# EasyEDA schematic SCH_6 Channel Energy Monitor 17-09-2023 Finished_2023-09-29.json
TITLE: 6 Channel Energy Monitor; REV: 1.0; Date: 2023-09-06; Sheet: 1/1; Drawn By: ChrisHayes31; Company: Shaw Communications
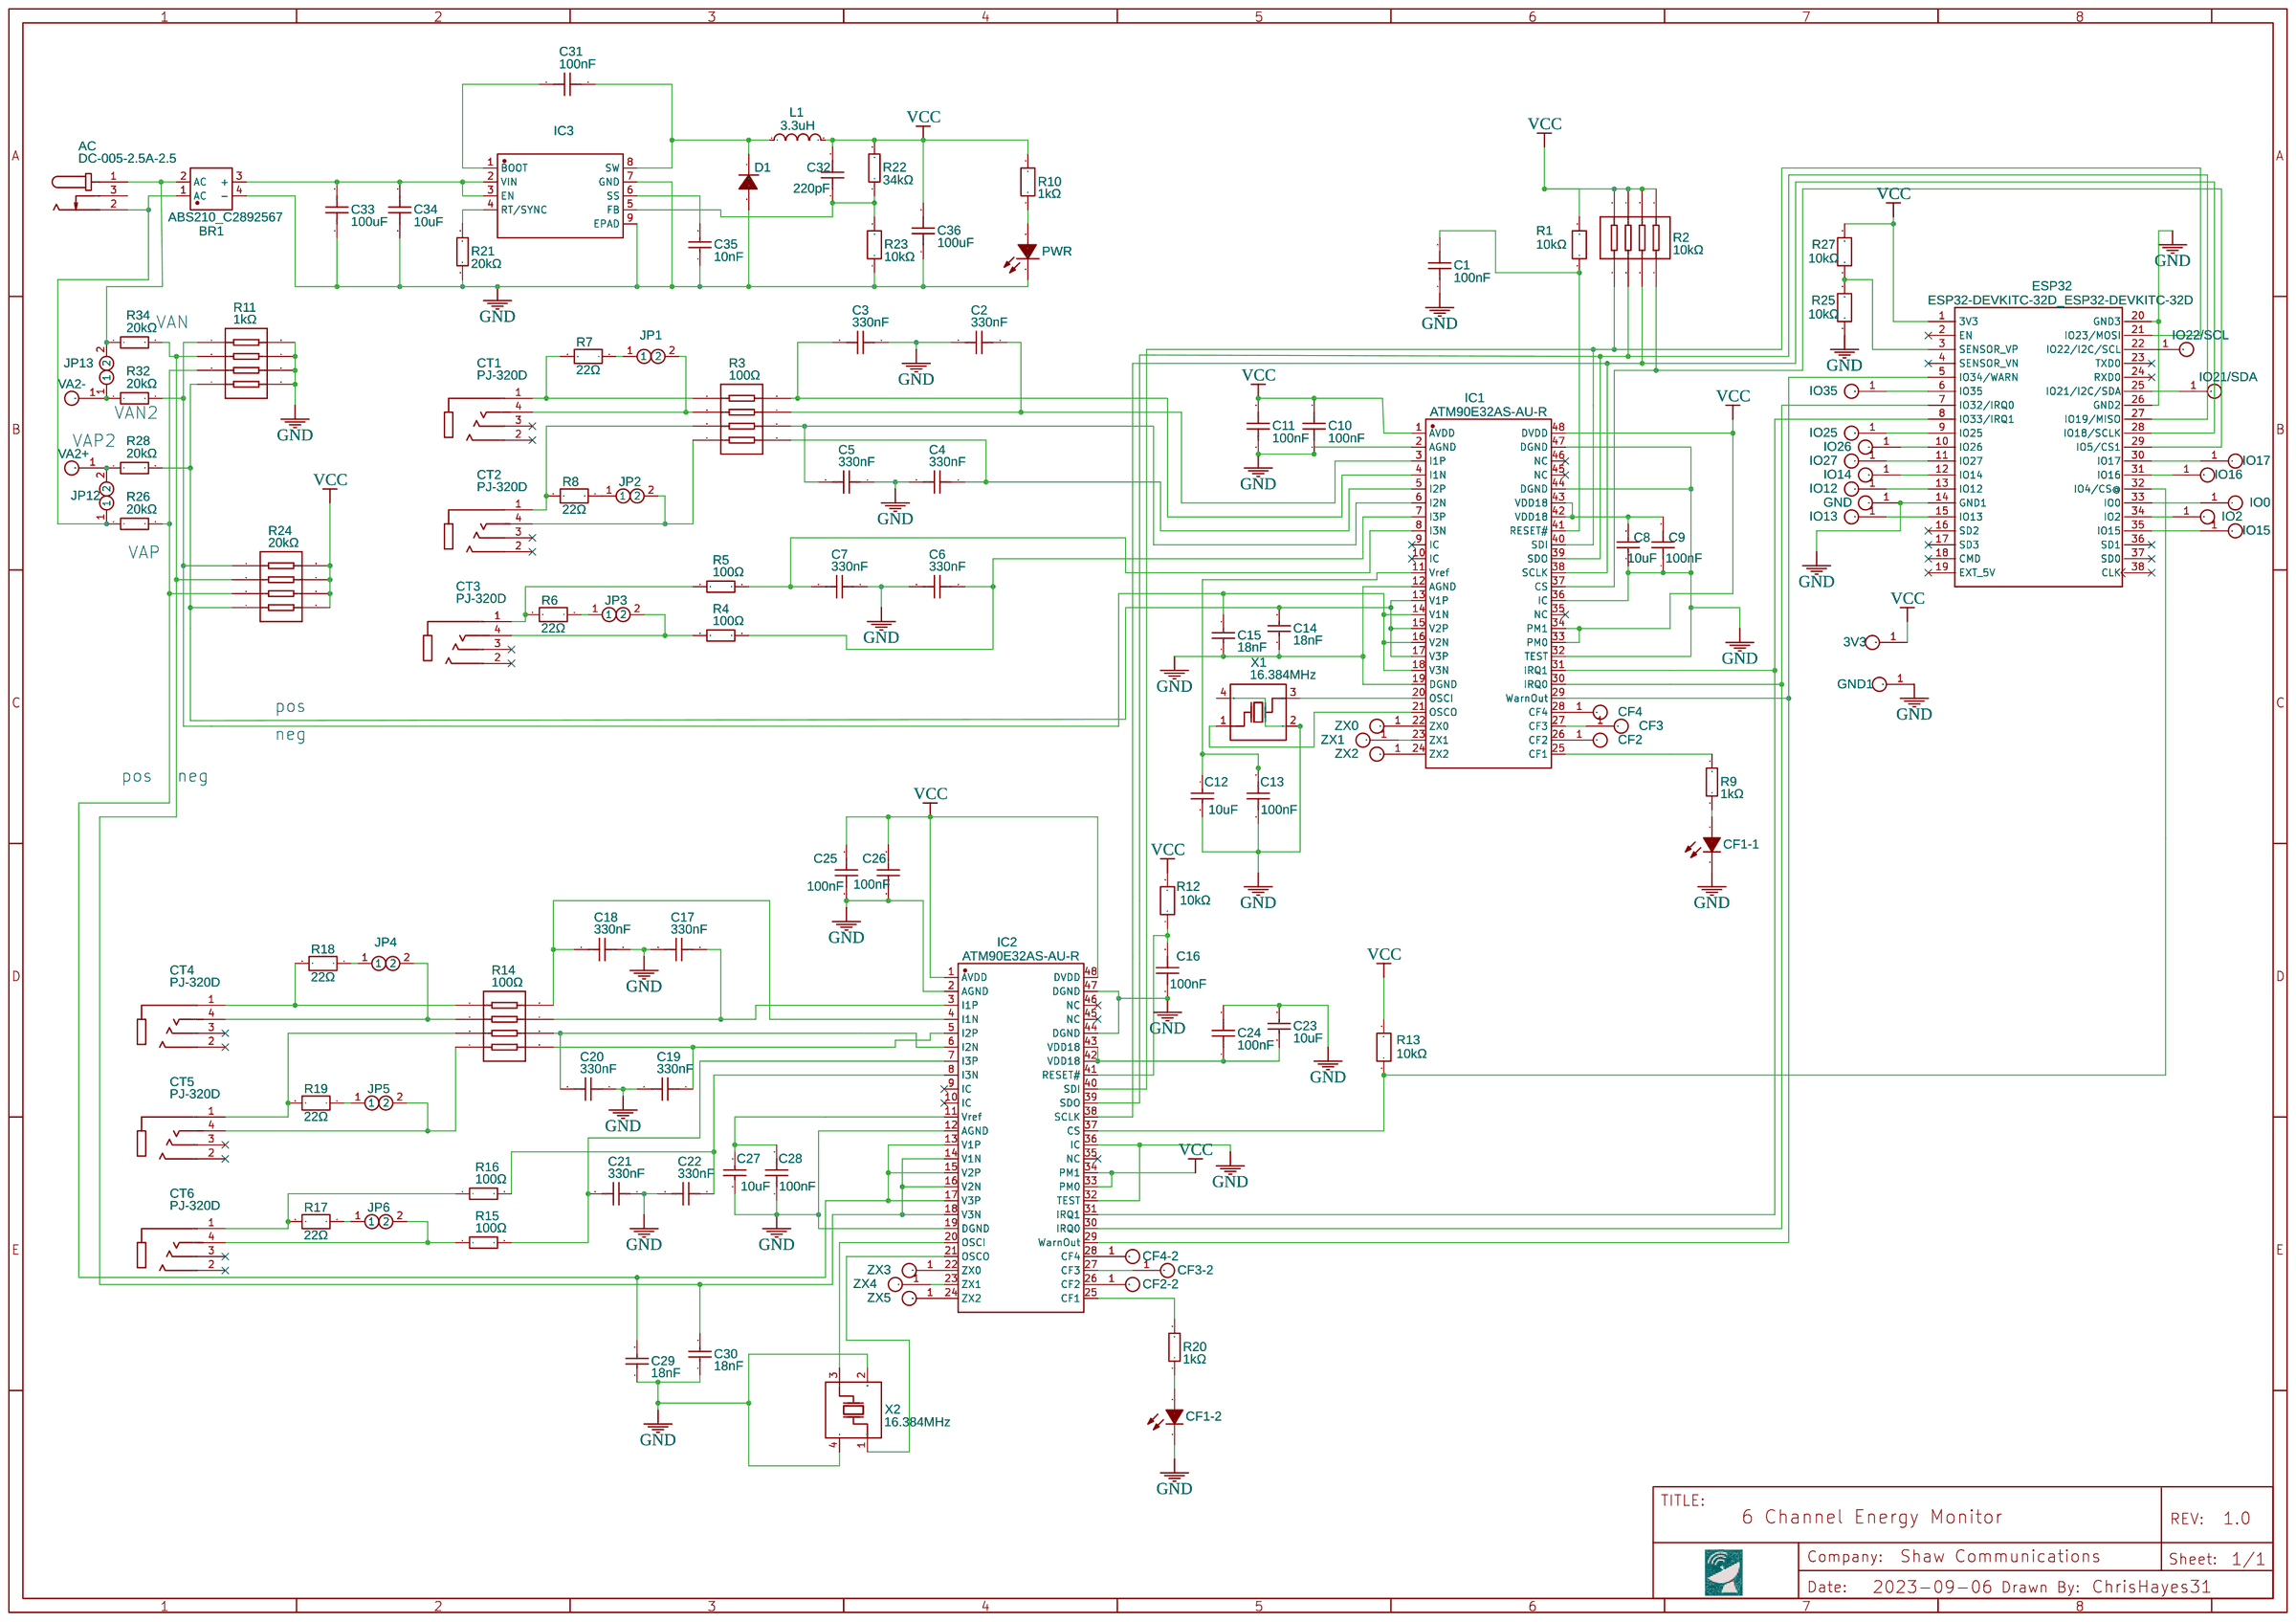
[diagram p0: schematic sheet]

## Parts
3V3  PAD-ROUND  [PADPAD]
AC  DC-005-2.5A-2.5  [CONN-TH_DC-005-2.5A-2.0]
BR1  ABS210_C2892567  [ABF_L5.1-W4.4-P4.00-LS6.2-BL]
C1  100nF  [C0805]
C2  330nF  [C0805]
C3  330nF  [C0805]
C4  330nF  [C0805]
C5  330nF  [C0805]
C6  330nF  [C0805]
C7  330nF  [C0805]
C8  10uF  [C0805]
C9  100nF  [C0805]
C10  100nF  [C0805]
C11  100nF  [C0805]
C12  10uF  [C0805]
C13  100nF  [C0805]
C14  18nF  [C0805]
C15  18nF  [C0805]
C16  100nF  [C0805]
C17  330nF  [C0805]
C18  330nF  [C0805]
C19  330nF  [C0805]
C20  330nF  [C0805]
C21  330nF  [C0805]
C22  330nF  [C0805]
C23  10uF  [C0805]
C24  100nF  [C0805]
C25  100nF  [C0805]
C26  100nF  [C0805]
C27  10uF  [C0805]
C28  100nF  [C0805]
C29  18nF  [C0805]
C30  18nF  [C0805]
C31  100nF  [C0805]
C32  220pF  [C0805]
C33  100uF  [C0805]
C34  10uF  [C0805]
C35  10nF  [C0805]
C36  100uF  [C0805]
CF1-1  FC-DA1608BK-470H10  [LED0603-RD]
CF1-2  FC-DA1608BK-470H10  [LED0603-RD]
CF2  PAD-ROUND  [PADPAD]
CF2-2  PAD-ROUND  [PADPAD]
CF3  PAD-ROUND  [PADPAD]
CF3-2  PAD-ROUND  [PADPAD]
CF4  PAD-ROUND  [PADPAD]
CF4-2  PAD-ROUND  [PADPAD]
CT1  PJ-320D  [AUDIO-SMD_PJ-320D]
CT2  PJ-320D  [AUDIO-SMD_PJ-320D]
CT3  PJ-320D  [AUDIO-SMD_PJ-320D]
CT4  PJ-320D  [AUDIO-SMD_PJ-320D]
CT5  PJ-320D  [AUDIO-SMD_PJ-320D]
CT6  PJ-320D  [AUDIO-SMD_PJ-320D]
D1  M7_C95872  [SMA_L4.3-W2.6-LS5.2-RD]
ESP32  ESP32-DEVKITC-32D_ESP32-DEVKITC-32D  [ESP32-DEVKITC-32D_MODULE_ESP32-DEVKITC-32D]
GND  PAD-ROUND  [PADPAD]
GND1  PAD-ROUND  [PADPAD]
IC1  ATM90E32AS-AU-R  [TQFP-48_L7.0-W7.0-P0.50-LS9.0-BL]
IC2  ATM90E32AS-AU-R  [TQFP-48_L7.0-W7.0-P0.50-LS9.0-BL]
IC3  LMR14020SDDAR  [HSOP-8_L5.0-W4.0-P1.27-LS6.2-BL-EP]
IO0  PAD-ROUND  [PADPAD]
IO2  PAD-ROUND  [PADPAD]
IO12  PAD-ROUND  [PADPAD]
IO13  PAD-ROUND  [PADPAD]
IO14  PAD-ROUND  [PADPAD]
IO15  PAD-ROUND  [PADPAD]
IO16  PAD-ROUND  [PADPAD]
IO17  PAD-ROUND  [PADPAD]
IO21/SDA  PAD-ROUND  [PADPAD]
IO22/SCL  PAD-ROUND  [PADPAD]
IO25  PAD-ROUND  [PADPAD]
IO26  PAD-ROUND  [PADPAD]
IO27  PAD-ROUND  [PADPAD]
IO35  PAD-ROUND  [PADPAD]
JP1  J-pad soldering  [PADTOPAD]
JP2  J-pad soldering  [PADTOPAD]
JP3  J-pad soldering  [PADTOPAD]
JP4  J-pad soldering  [PADTOPAD]
JP5  J-pad soldering  [PADTOPAD]
JP6  J-pad soldering  [PADTOPAD]
JP12  J-pad soldering  [PADTOPAD]
JP13  J-pad soldering  [PADTOPAD]
L1  3.3uH  [IND-SMD_L7.2-W6.6_GPSR07X0]
PWR  EL0603/G6C-A01/DT(TS)(GW)  [LED0603-R-RD_GREEN]
R1  10kΩ  [R0805]
R2  10kΩ  [RES-ARRAY-SMD_0603-8P-L3.2-W1.6-BL]
R3  100Ω  [RES-ARRAY-SMD_0603-8P-L3.2-W1.6-BL]
R4  100Ω  [R0805]
R5  100Ω  [R0805]
R6  22Ω  [R0805]
R7  22Ω  [R0805]
R8  22Ω  [R0805]
R9  1kΩ  [R0805]
R10  1kΩ  [R0805]
R11  1kΩ  [RES-ARRAY-SMD_0603-8P-L3.2-W1.6-BL]
R12  10kΩ  [R0805]
R13  10kΩ  [R0805]
R14  100Ω  [RES-ARRAY-SMD_0603-8P-L3.2-W1.6-BL]
R15  100Ω  [R0805]
R16  100Ω  [R0805]
R17  22Ω  [R0805]
R18  22Ω  [R0805]
R19  22Ω  [R0805]
R20  1kΩ  [R0805]
R21  20kΩ  [R0805]
R22  34kΩ  [R0805]
R23  10kΩ  [R0805]
R24  20kΩ  [RES-ARRAY-SMD_0603-8P-L3.2-W1.6-BL]
R25  10kΩ  [R0805]
R26  20kΩ  [R0805]
R27  10kΩ  [R0805]
R28  20kΩ  [R0805]
R32  20kΩ  [R0805]
R34  20kΩ  [R0805]
VA2+  PAD-ROUND  [PADPAD]
VA2-  PAD-ROUND  [PADPAD]
X1  16.384MHz  [CRYSTAL-SMD_4P-L3.2-W2.5-BL]
X2  16.384MHz  [CRYSTAL-SMD_4P-L3.2-W2.5-BL]
ZX0  PAD-ROUND  [PADPAD]
ZX1  PAD-ROUND  [PADPAD]
ZX2  PAD-ROUND  [PADPAD]
ZX3  PAD-ROUND  [PADPAD]
ZX4  PAD-ROUND  [PADPAD]
ZX5  PAD-ROUND  [PADPAD]

## Library data of the parts
3V3 CF2 CF2-2 CF3 CF3-2 CF4 CF4-2 GND GND1 IO0 IO2 IO12-IO17 IO21/SDA IO22/SCL IO25-IO27 IO35 VA2+ VA2- ZX0-ZX5 = PAD-ROUND: Contributor: hippenium
AC = DC-005-2.5A-2.5: Contributor: LCSC; Supplier: LCSC; Supplier Part: C319098; Manufacturer: XKB Enterprise; JLCPCB Part Class: Extended Part; link: https://lcsc.com/eda_search?q=C319098&%26type=1&ref=editor
BR1 = ABS210_C2892567: Contributor: lcsc; Supplier: LCSC; Supplier Part: C2892567; Manufacturer: YONGYUTAI(永裕泰); Manufacturer Part: ABS210; JLCPCB Part Class: Extended Part; link: https://lcsc.com/eda_search?q=C2892567&%26type=1&ref=editor
C1 C9-C11 C13 C16 C24-C26 C28 = CGJ4J2X7R1E104K125AA: Contributor: lcsc; Supplier: LCSC; Supplier Part: C3848658; Manufacturer: TDK; link: https://lcsc.com/eda_search?q=C3848658&%26type=1&ref=editor
C2-C7 C17-C22 = TCC0805X7R334K500DT: Contributor: LCSC; Supplier: LCSC; Supplier Part: C309049; Manufacturer: CCTC(三环); JLCPCB Part Class: Extended Part; link: https://lcsc.com/eda_search?q=C309049&%26type=1&ref=editor
C8 C12 C23 C27 = CC0805KKX5R8BB106: Supplier: LCSC; Manufacturer: YAGEO(国巨); Supplier Part: C89831; JLCPCB Part Class: Extended Part; link: https://lcsc.com/eda_search?q=C89831&%26type=1&ref=editor
C14 C15 C29 C30 = CC0805KRX7R9BB183: Supplier: LCSC; Manufacturer: YAGEO(国巨); Supplier Part: C113857; JLCPCB Part Class: Extended Part; link: https://lcsc.com/eda_search?q=C113857&%26type=1&ref=editor
C31 = CC0805JRX7R7BB104: Contributor: lcsc; Supplier: LCSC; Supplier Part: C520082; Manufacturer: YAGEO(国巨); link: https://lcsc.com/eda_search?q=C520082&%26type=1&ref=editor
C32 = CC0805JRNPO0BN221: Contributor: LCSC; Supplier: LCSC; Supplier Part: C113819; Manufacturer: YAGEO(国巨); JLCPCB Part Class: Extended Part; link: https://lcsc.com/eda_search?q=C113819&%26type=1&ref=editor
C33 C36 = GRM21BC80E107ME15L: Contributor: lcsc; Supplier: LCSC; Supplier Part: C2167924; Manufacturer: muRata(村田); JLCPCB Part Class: Extended Part; link: https://lcsc.com/eda_search?q=C2167924&%26type=1&ref=editor
C34 = CC0805KKX7R7BB106: Contributor: LCSC; Supplier: LCSC; Supplier Part: C326595; Manufacturer: YAGEO(国巨); JLCPCB Part Class: Extended Part; link: https://lcsc.com/eda_search?q=C326595&%26type=1&ref=editor
C35 = CC0805KKX7RBBB103: Supplier: LCSC; Manufacturer: YAGEO(国巨); Supplier Part: C106840; JLCPCB Part Class: Extended Part; link: https://lcsc.com/eda_search?q=C106840&%26type=1&ref=editor
CF1-1 CF1-2 = FC-DA1608BK-470H10: Supplier: LCSC; Manufacturer: 国星光电; Manufacturer Part: NCD0603B1; Supplier Part: C84266; JLCPCB Part Class: Extended Part; link: https://lcsc.com/eda_search?q=C84266&%26type=1&ref=editor
CT1-CT6 = PJ-320D: Contributor: LCSC; Supplier: LCSC; Supplier Part: C431535; Manufacturer: SHOU HAN; JLCPCB Part Class: Extended Part; link: https://lcsc.com/eda_search?q=C431535&%26type=1&ref=editor
D1 = M7_C95872: Supplier: LCSC; Manufacturer: MDD; Manufacturer Part: M7; Supplier Part: C95872; JLCPCB Part Class: Basic Part; link: https://lcsc.com/eda_search?q=C95872&%26type=1&ref=editor
ESP32 = ESP32-DEVKITC-32D_ESP32-DEVKITC-32D: Contributor: 0AlphaOmega
IC1 IC2 = ATM90E32AS-AU-R: Contributor: LCSC; Supplier: LCSC; Supplier Part: C177153; Manufacturer: MICROCHIP(美国微芯); JLCPCB Part Class: Extended Part; link: https://lcsc.com/eda_search?q=C177153&%26type=1&ref=editor
IC3 = LMR14020SDDAR: Contributor: LCSC; Supplier: LCSC; Supplier Part: C187824; Manufacturer: TI(德州仪器); JLCPCB Part Class: Extended Part; link: https://lcsc.com/eda_search?q=C187824&%26type=1&ref=editor
JP1-JP6 JP12 JP13 = J-pad soldering: Contributor: sandstorm
L1 = CYA0630-3.3UH: Contributor: lcsc; Supplier: LCSC; Supplier Part: C5189747; Manufacturer: SHOU HAN(首韩); JLCPCB Part Class: Extended Part; link: https://lcsc.com/eda_search?q=C5189747&%26type=1&ref=editor
PWR = EL0603/G6C-A01/DT(TS)(GW): Contributor: lcsc; Supplier: LCSC; Supplier Part: C1322294; Manufacturer: EVERLIGHT(亿光); JLCPCB Part Class: Extended Part; link: https://lcsc.com/eda_search?q=C1322294&%26type=1&ref=editor
R1 R12 R13 R25 R27 = SCR0805F10K: Contributor: lcsc; Supplier: LCSC; Supplier Part: C3016734; Manufacturer: VO(翔胜); JLCPCB Part Class: Extended Part; link: https://lcsc.com/eda_search?q=C3016734&%26type=1&ref=editor
R2 = 4D03WGJ0103T5E: Supplier: LCSC; Manufacturer: UNI-ROYAL(厚声); Supplier Part: C29718; JLCPCB Part Class: Basic Part; link: https://lcsc.com/eda_search?q=C29718&%26type=1&ref=editor
R3 R14 = 4D03WGJ0101T5E: Supplier: LCSC; Manufacturer: UNI-ROYAL(厚声); Supplier Part: C25506; JLCPCB Part Class: Extended Part; link: https://lcsc.com/eda_search?q=C25506&%26type=1&ref=editor
R4 R5 R15 R16 = 0805W8F1000T5E: Supplier: LCSC; Manufacturer: UNI-ROYAL(厚声); Supplier Part: C17408; JLCPCB Part Class: Basic Part; link: https://lcsc.com/eda_search?q=C17408&%26type=1&ref=editor
R6-R8 R17-R19 = SCR0805F22R: Contributor: lcsc; Supplier: LCSC; Supplier Part: C3016596; Manufacturer: VO(翔胜); JLCPCB Part Class: Extended Part; link: https://lcsc.com/eda_search?q=C3016596&%26type=1&ref=editor
R9 R20 = CR0805F81001G: Supplier: LCSC; Manufacturer: LIZ(丽智电子); Supplier Part: C101404; JLCPCB Part Class: Extended Part; link: https://lcsc.com/eda_search?q=C101404&%26type=1&ref=editor
R10 = SCR0805F1K: Contributor: lcsc; Supplier: LCSC; Supplier Part: C3016664; Manufacturer: VO(翔胜); JLCPCB Part Class: Extended Part; link: https://lcsc.com/eda_search?q=C3016664&%26type=1&ref=editor
R11 = 4D03WGJ0102T5E: Supplier: LCSC; Manufacturer: UNI-ROYAL(厚声); Supplier Part: C20197; JLCPCB Part Class: Basic Part; link: https://lcsc.com/eda_search?q=C20197&%26type=1&ref=editor
R21 = QR0805F20KP05: Contributor: LCSC; Supplier: LCSC; Supplier Part: C176202; Manufacturer: EVER OHMS(天二科技); Manufacturer Part: QR0805F20K0P05Z; JLCPCB Part Class: Extended Part; link: https://lcsc.com/eda_search?q=C176202&%26type=1&ref=editor
R22 = AC0805FR-0734KL: Contributor: LCSC; Supplier: LCSC; Supplier Part: C228760; Manufacturer: YAGEO(国巨); JLCPCB Part Class: Extended Part; link: https://lcsc.com/eda_search?q=C228760&%26type=1&ref=editor
R23 = CR0805J10K0P05Z: Contributor: LCSC; Supplier: LCSC; Supplier Part: C881258; Manufacturer: EVER OHMS(天二科技); JLCPCB Part Class: Extended Part; link: https://lcsc.com/eda_search?q=C881258&%26type=1&ref=editor
R24 = 4D03WGJ0203T5E: Supplier: LCSC; Manufacturer: UNI-ROYAL(厚声); Supplier Part: C12004; JLCPCB Part Class: Extended Part; link: https://lcsc.com/eda_search?q=C12004&%26type=1&ref=editor
R26 R28 R32 R34 = RK73H2ATTD2002F: Contributor: LCSC; Supplier: LCSC; Supplier Part: C276221; Manufacturer: KOA; JLCPCB Part Class: Extended Part; link: https://lcsc.com/eda_search?q=C276221&%26type=1&ref=editor
X1 X2 = X322516384MSB4SI: Supplier: LCSC; Manufacturer: YXC(扬兴晶振); Supplier Part: C13739; JLCPCB Part Class: Extended Part; link: https://lcsc.com/eda_search?q=C13739&%26type=1&ref=editor

## Nets
GND: BR1.4(-) C1.1 C2.2 C3.1 C4.2 C5.1 C6.2 C7.1 C8.1 C9.1 C10.1 C11.1 C12.2 C13.1 C14.1 C15.1 C16.1 C17.2 C18.1 C19.2 C20.1 C21.1 C22.2 C23.2 C24.2 C25.1 C26.1 C27.2 C28.1 C29.1 C30.1 C33.1 C34.2 C35.1 C36.1 CF1-1.1(-) CF1-2.1(-) D1.2(A) ESP32.14(GND1) ESP32.20(GND3) ESP32.26(GND2) GND.1(Pad) GND1.1(Pad) IC1.2(AGND) IC1.12(AGND) IC1.19(DGND) IC1.32(TEST) IC1.36(IC) IC1.44(DGND) IC1.47(DGND) IC2.2(AGND) IC2.12(AGND) IC2.19(DGND) IC2.32(TEST) IC2.36(IC) IC2.44(DGND) IC2.47(DGND) IC3.7(GND) IC3.9(EPAD) PWR.2(K) R11.5 R11.6 R11.7 R11.8 R21.1 R23.1 R25.1 X1.2(GND) X1.4(GND) X2.2(GND) X2.4(GND)
VCC: 3V3.1(Pad) C10.2 C11.2 C25.2 C26.2 C32.2 C36.2 ESP32.1(3V3) IC1.1(AVDD) IC1.33(PM0) IC1.34(PM1) IC1.48(DVDD) IC2.1(AVDD) IC2.33(PM0) IC2.34(PM1) IC2.48(DVDD) L1.2 R1.2 R2.5 R2.6 R2.7 R2.8 R10.2 R12.2 R13.2 R22.2 R24.5 R24.6 R24.7 R24.8 R27.2
Net-(AC-1): AC.1 BR1.2(AC) JP13.2 R34.1
Net-(AC-2): AC.2 BR1.1(AC) JP12.1 R26.1
Net-(BR1-3): BR1.3(+) C33.2 C34.1 IC3.2(VIN) IC3.3(EN)
Net-(C1-2): C1.2 IC1.41(RESET#) R1.1
Net-(C2-1): C2.1 IC1.3(I1P) R3.7
Net-(C3-2): C3.2 IC1.4(I1N) R3.8
Net-(C4-1): C4.1 IC1.5(I2P) R3.5
Net-(C5-2): C5.2 IC1.6(I2N) R3.6
Net-(C6-1): C6.1 IC1.7(I3P) R4.2
Net-(C7-2): C7.2 IC1.8(I3N) R5.2
Net-(C8-2): C8.2 C9.2 IC1.42(VDD18) IC1.43(VDD18)
Net-(C12-1): C12.1 C13.2 IC1.11(Vref)
Net-(C14-2): C14.2 IC1.13(V1P) IC1.15(V2P) IC1.17(V3P) R11.4 R24.4 R28.2
Net-(C15-2): C15.2 IC1.14(V1N) IC1.16(V2N) IC1.18(V3N) R11.1 R24.1 R32.2
Net-(C16-2): C16.2 IC2.41(RESET#) R12.1
Net-(C17-1): C17.1 IC2.3(I1P) R14.7
Net-(C18-2): C18.2 IC2.4(I1N) R14.8
Net-(C19-1): C19.1 IC2.5(I2P) R14.5
Net-(C20-2): C20.2 IC2.6(I2N) R14.6
Net-(C21-2): C21.2 IC2.7(I3P) R15.2
Net-(C22-1): C22.1 IC2.8(I3N) R16.2
Net-(C23-1): C23.1 C24.1 IC2.42(VDD18) IC2.43(VDD18)
Net-(C27-1): C27.1 C28.2 IC2.11(Vref)
Net-(C29-2): C29.2 IC2.13(V1P) IC2.15(V2P) IC2.17(V3P) R11.3 R24.3 R26.2
Net-(C30-2): C30.2 IC2.14(V1N) IC2.16(V2N) IC2.18(V3N) R11.2 R24.2 R34.2
Net-(C31-1): C31.1 D1.1(K) IC3.8(SW) L1.1
Net-(C31-2): C31.2 IC3.1(BOOT)
Net-(C32-1): C32.1 IC3.5(FB) R22.1 R23.2
Net-(C35-2): C35.2 IC3.6(SS)
Net-(CF1-1-2): CF1-1.2(+) R9.1
Net-(CF1-2-2): CF1-2.2(+) R20.1
Net-(CF2-1): CF2.1(Pad) IC1.26(CF2)
Net-(CF2-2-1): CF2-2.1(Pad) IC2.26(CF2)
Net-(CF3-1): CF3.1(Pad) IC1.27(CF3)
Net-(CF3-2-1): CF3-2.1(Pad) IC2.27(CF3)
Net-(CF4-1): CF4.1(Pad) IC1.28(CF4)
Net-(CF4-2-1): CF4-2.1(Pad) IC2.28(CF4)
Net-(CT1-1): CT1.1 R3.1 R7.2
Net-(CT1-4): CT1.4 JP1.2 R3.2
Net-(CT2-1): CT2.1 R3.3 R8.2
Net-(CT2-4): CT2.4 JP2.2 R3.4
Net-(CT3-1): CT3.1 R5.1 R6.2
Net-(CT3-4): CT3.4 JP3.2 R4.1
Net-(CT4-1): CT4.1 R14.1 R18.2
Net-(CT4-4): CT4.4 JP4.2 R14.2
Net-(CT5-1): CT5.1 R14.3 R19.2
Net-(CT5-4): CT5.4 JP5.2 R14.4
Net-(CT6-1): CT6.1 R16.1 R17.2
Net-(CT6-4): CT6.4 JP6.2 R15.1
Net-(ESP32-3): ESP32.3(SENSOR_VP) R25.2 R27.1
Net-(ESP32-5): ESP32.5(IO34/WARN) IC1.29(WarnOut) IC2.29(WarnOut)
Net-(ESP32-6): ESP32.6(IO35) IO35.1(Pad)
Net-(ESP32-7): ESP32.7(IO32/IRQ0) IC1.30(IRQ0) IC2.30(IRQ0)
Net-(ESP32-8): ESP32.8(IO33/IRQ1) IC1.31(IRQ1) IC2.31(IRQ1)
Net-(ESP32-9): ESP32.9(IO25) IO25.1(Pad)
Net-(ESP32-10): ESP32.10(IO26) IO26.1(Pad)
Net-(ESP32-11): ESP32.11(IO27) IO27.1(Pad)
Net-(ESP32-12): ESP32.12(IO14) IO14.1(Pad)
Net-(ESP32-13): ESP32.13(IO12) IO12.1(Pad)
Net-(ESP32-15): ESP32.15(IO13) IO13.1(Pad)
Net-(ESP32-21): ESP32.21(IO23/MOSI) IC1.40(SDI) IC2.40(SDI) R2.1
Net-(ESP32-22): ESP32.22(IO22/I2C/SCL) IO22/SCL.1(Pad)
Net-(ESP32-25): ESP32.25(IO21/I2C/SDA) IO21/SDA.1(Pad)
Net-(ESP32-27): ESP32.27(IO19/MISO) IC1.39(SDO) IC2.39(SDO) R2.2
Net-(ESP32-28): ESP32.28(IO18/SCLK) IC1.38(SCLK) IC2.38(SCLK) R2.3
Net-(ESP32-29): ESP32.29(IO5/CS1) IC1.37(CS) R2.4
Net-(ESP32-30): ESP32.30(IO17) IO17.1(Pad)
Net-(ESP32-31): ESP32.31(IO16) IO16.1(Pad)
Net-(ESP32-32): ESP32.32(IO4/CS@) IC2.37(CS) R13.1
Net-(ESP32-33): ESP32.33(IO0) IO0.1(Pad)
Net-(ESP32-34): ESP32.34(IO2) IO2.1(Pad)
Net-(ESP32-35): ESP32.35(IO15) IO15.1(Pad)
Net-(IC1-20): IC1.20(OSCI) X1.3(OSC2)
Net-(IC1-21): IC1.21(OSCO) X1.1(OSC1)
Net-(IC1-22): IC1.22(ZX0) ZX0.1(Pad)
Net-(IC1-23): IC1.23(ZX1) ZX1.1(Pad)
Net-(IC1-24): IC1.24(ZX2) ZX2.1(Pad)
Net-(IC1-25): IC1.25(CF1) R9.2
Net-(IC2-20): IC2.20(OSCI) X2.3(OSC2)
Net-(IC2-21): IC2.21(OSCO) X2.1(OSC1)
Net-(IC2-22): IC2.22(ZX0) ZX3.1(Pad)
Net-(IC2-23): IC2.23(ZX1) ZX4.1(Pad)
Net-(IC2-24): IC2.24(ZX2) ZX5.1(Pad)
Net-(IC2-25): IC2.25(CF1) R20.2
Net-(IC3-4): IC3.4(RT/SYNC) R21.2
Net-(JP1-1): JP1.1 R7.1
Net-(JP2-1): JP2.1 R8.1
Net-(JP3-1): JP3.1 R6.1
Net-(JP4-1): JP4.1 R18.1
Net-(JP5-1): JP5.1 R19.1
Net-(JP6-1): JP6.1 R17.1
Net-(JP12-2): JP12.2 R28.1 VA2+.1(Pad)
Net-(JP13-1): JP13.1 R32.1 VA2-.1(Pad)
Net-(PWR-1): PWR.1(A) R10.1

Not connected (* = marked no-connect by the designer): AC 3; CT1 2* 3*; CT2 2* 3*; CT3 2* 3*; CT4 2* 3*; CT5 2* 3*; CT6 2* 3*; ESP32 2(EN)* 4(SENSOR_VN)* 16(SD2)* 17(SD3)* 18(CMD)* 19(EXT_5V)* 23(TXD0)* 24(RXD0)* 36(SD1)* 37(SD0)* 38(CLK)*; IC1 9(IC)* 10(IC)* 35(NC)* 45(NC)* 46(NC)*; IC2 9(IC)* 10(IC)* 35(NC)* 45(NC)* 46(NC)*

## Notes on the sheet
- VAN
- VAN2
- VAP2
- VAP
- pos
- neg
- pos
- neg
